# Altium schematic sheet SensorPCBA_v0.1.SchDoc
size 420 x 297 mm; SheetNumber: 1; SheetTotal: 1
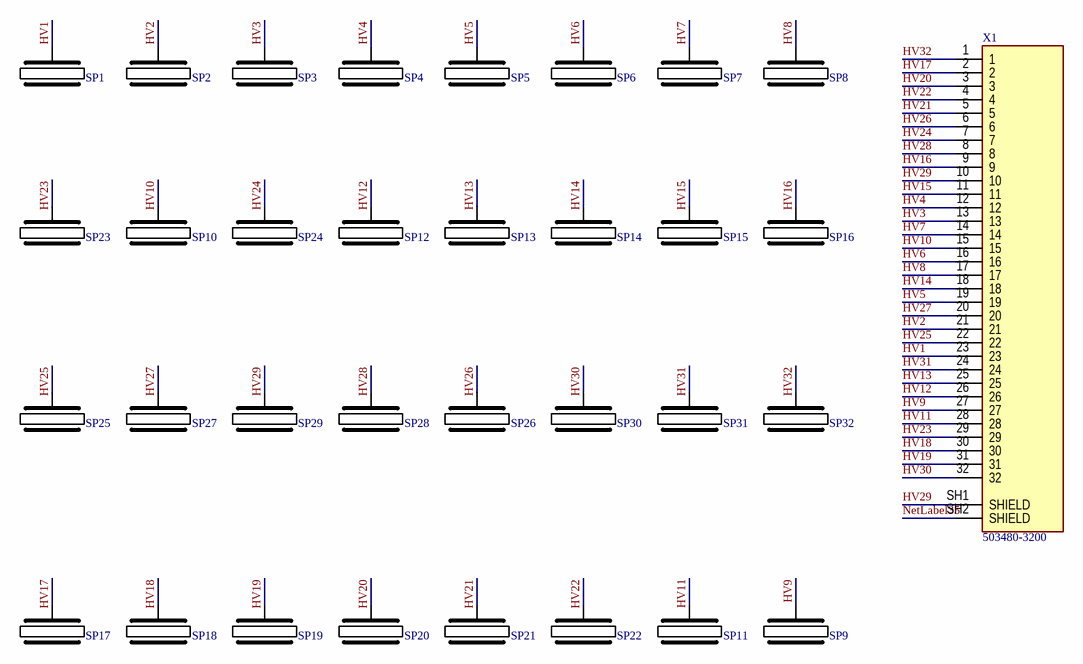
[diagram p0: SensorPCBA_v0.1.SchDoc]

## Parts
SP1  SensorPAD  [Pump_via]  (value not drawn)
SP2  SensorPAD  [Pump_via]  (value not drawn)
SP3  SensorPAD  [Pump_via]  (value not drawn)
SP4  SensorPAD  [Pump_via]  (value not drawn)
SP5  SensorPAD  [Pump_via]  (value not drawn)
SP6  SensorPAD  [Pump_via]  (value not drawn)
SP7  SensorPAD  [Pump_via]  (value not drawn)
SP8  SensorPAD  [Pump_via]  (value not drawn)
SP9  SensorPAD  [Pump_via]  (value not drawn)
SP10  SensorPAD  [Pump_via]  (value not drawn)
SP11  SensorPAD  [Pump_via]  (value not drawn)
SP12  SensorPAD  [Pump_via]  (value not drawn)
SP13  SensorPAD  [Pump_via]  (value not drawn)
SP14  SensorPAD  [Pump_via]  (value not drawn)
SP15  SensorPAD  [Pump_via]  (value not drawn)
SP16  SensorPAD  [Pump_via]  (value not drawn)
SP17  SensorPAD  [Pump_via]  (value not drawn)
SP18  SensorPAD  [Pump_via]  (value not drawn)
SP19  SensorPAD  [Pump_via]  (value not drawn)
SP20  SensorPAD  [Pump_via]  (value not drawn)
SP21  SensorPAD  [Pump_via]  (value not drawn)
SP22  SensorPAD  [Pump_via]  (value not drawn)
SP23  SensorPAD  [Pump_via]  (value not drawn)
SP24  SensorPAD  [Pump_via]  (value not drawn)
SP25  SensorPAD  [Pump_via]  (value not drawn)
SP26  SensorPAD  [Pump_via]  (value not drawn)
SP27  SensorPAD  [Pump_via]  (value not drawn)
SP28  SensorPAD  [Pump_via]  (value not drawn)
SP29  SensorPAD  [Pump_via]  (value not drawn)
SP30  SensorPAD  [Pump_via]  (value not drawn)
SP31  SensorPAD  [Pump_via]  (value not drawn)
SP32  SensorPAD  [Pump_via]  (value not drawn)
X1  503480-3200  [MOLEX_503480-3200]

## Nets
HV1: SP1.1(Atop) X1.23
HV2: SP2.1(Atop) X1.21
HV3: SP3.1(Atop) X1.13
HV4: SP4.1(Atop) X1.12
HV5: SP5.1(Atop) X1.19
HV6: SP6.1(Atop) X1.16
HV7: SP7.1(Atop) X1.14
HV8: SP8.1(Atop) X1.17
HV9: SP9.1(Atop) X1.27
HV10: SP10.1(Atop) X1.15
HV11: SP11.1(Atop) X1.28
HV12: SP12.1(Atop) X1.26
HV13: SP13.1(Atop) X1.25
HV14: SP14.1(Atop) X1.18
HV15: SP15.1(Atop) X1.11
HV16: SP16.1(Atop) X1.9
HV17: SP17.1(Atop) X1.2
HV18: SP18.1(Atop) X1.30
HV19: SP19.1(Atop) X1.31
HV20: SP20.1(Atop) X1.3
HV21: SP21.1(Atop) X1.5
HV22: SP22.1(Atop) X1.4
HV23: SP23.1(Atop) X1.29
HV24: SP24.1(Atop) X1.7
HV25: SP25.1(Atop) X1.22
HV26: SP26.1(Atop) X1.6
HV27: SP27.1(Atop) X1.20
HV28: SP28.1(Atop) X1.8
HV29: SP29.1(Atop) X1.10 X1.SH1(SHIELD)
HV30: SP30.1(Atop) X1.32
HV31: SP31.1(Atop) X1.24
HV32: SP32.1(Atop) X1.1
NetLabel35: X1.SH2(SHIELD)

## Notes on the sheet
- Перв. примен.
- Справ. №
- Подп. и дата
- Инв. № дубл.
- Взам. инв. №
- Разраб.
- Изм.
- Лист
- № докум.
- Подп.
- Дата
- Лит.
- Масса
- Масштаб
- Пров.
- Т. контр.
- Листов
- Инв. № подл.
- Н. контр.
- Утв.
- Копировал
- Формат А3

## Library data of the parts
X1 = 503480-3200: 32 Position FFC, FPC Connector Contacts, Top and Bottom 0.020 (0.50mm) Surface Mount, Right Angle; MF: Molex; MP: 5034803200; SnapEDA_Link: https://www.snapeda.com/parts/5034803200/Molex/view-part/?ref=snap; Package: None; Value: *; Check_prices: https://www.snapeda.com/parts/5034803200/Molex/view-part/?ref=eda